# EAGLE schematic TPA6120_Test_vINVERTED (EAGLE 6.4)
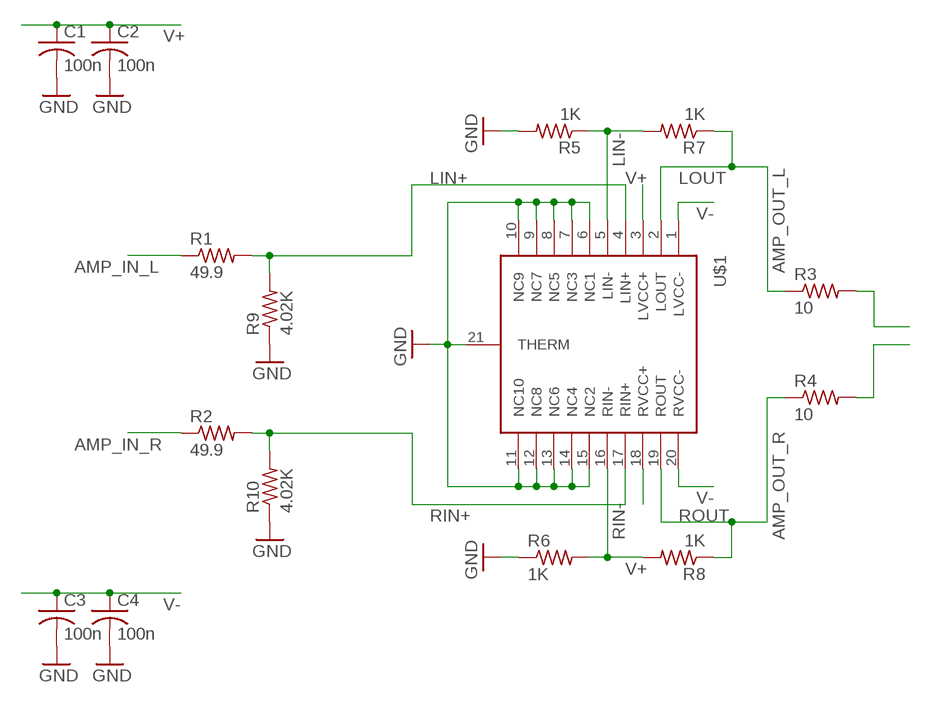
[diagram p0: schematic, sheet 1]

## Parts
C1  100n  C-USC0603  [C0603]
C2  100n  C-USC0603  [C0603]
C3  100n  C-USC0603  [C0603]
C4  100n  C-USC0603  [C0603]
R1  49.9  R-US_R0805  [R0805]
R2  49.9  R-US_R0805  [R0805]
R3  10  R-US_R1206  [R1206]
R4  10  R-US_R1206  [R1206]
R5  1K  R-US_R0805  [R0805]
R6  1K  R-US_R0805  [R0805]
R7  1K  R-US_R0805  [R0805]
R8  1K  R-US_R0805  [R0805]
R9  4.02K  R-US_R0805  [R0805]
R10  4.02K  R-US_R0805  [R0805]
U$1  TPA6120_TPA6120  [TPA6120_TPA6120]

## Nets
AMP_IN_L: R1.1
AMP_IN_R: R2.1
AMP_OUT_L: R3.2
AMP_OUT_R: R4.2
GND: C1.2 C2.2 C3.2 C4.2 R5.2 R6.1 R9.1 R10.1 U$1.6(NC1) U$1.7(NC3) U$1.8(NC5) U$1.9(NC7) U$1.10(NC9) U$1.11(NC10) U$1.12(NC8) U$1.13(NC6) U$1.14(NC4) U$1.15(NC2) U$1.21(THERM)
LIN+: R1.2 R9.2 U$1.4(LIN+)
LIN-: R5.1 R7.2 U$1.5(LIN-)
LOUT: R3.1 R7.1 U$1.2(LOUT)
RIN+: R2.2 R10.2 U$1.17(RIN+)
RIN-: R6.2 R8.2 U$1.16(RIN-)
ROUT: R4.1 R8.1 U$1.19(ROUT)
V+: C1.1 C2.1 U$1.3(LVCC+) U$1.18(RVCC+)
V-: C3.1 C4.1 U$1.1(LVCC-) U$1.20(RVCC-)

## Library data of the parts
C1-C4 = rcl:C-US: CAPACITOR, American symbol
R1-R10 = rcl:R-US_: RESISTOR, American symbol
U$1 = amp:TPA6120_TPA6120